# Altium schematic sheet xARMtoR.SchDoc
size A; SheetNumber: 1; SheetTotal: 1
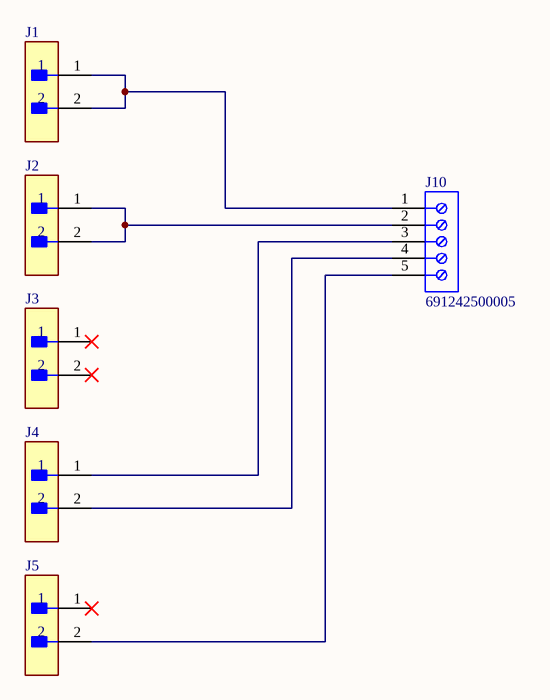
[diagram p0: xARMtoR.SchDoc]

## Parts
J1  M50-3530242  [FP-M50-3530242-MFG]  (value not drawn)
J2  M50-3530242  [FP-M50-3530242-MFG]  (value not drawn)
J3  M50-3530242  [FP-M50-3530242-MFG]  (value not drawn)
J4  M50-3530242  [FP-M50-3530242-MFG]  (value not drawn)
J5  M50-3530242  [FP-M50-3530242-MFG]  (value not drawn)
J10  691242500005  [691242500005]

## Nets
NetJ1_1: J1.1 J1.2 J10.1
NetJ2_1: J2.1 J2.2 J10.2
NetJ4_1: J4.1 J10.3
NetJ4_2: J4.2 J10.4
NetJ5_2: J5.2 J10.5

Not connected (* = marked no-connect by the designer): J3 1* 2*; J5 1*

## Library data of the parts
J1-J5 = CMP-15831-000040-1: CONN HEADER VERT 2POS 1.27MM
J10 = CMP-1502-02630-3: Terminal Block, 5.08MM Pitch, Vertical, Rising Cage Clamp, 12-30 AWG, 5 Pin